# Altium schematic sheet general_Interface.SchDoc
size A4
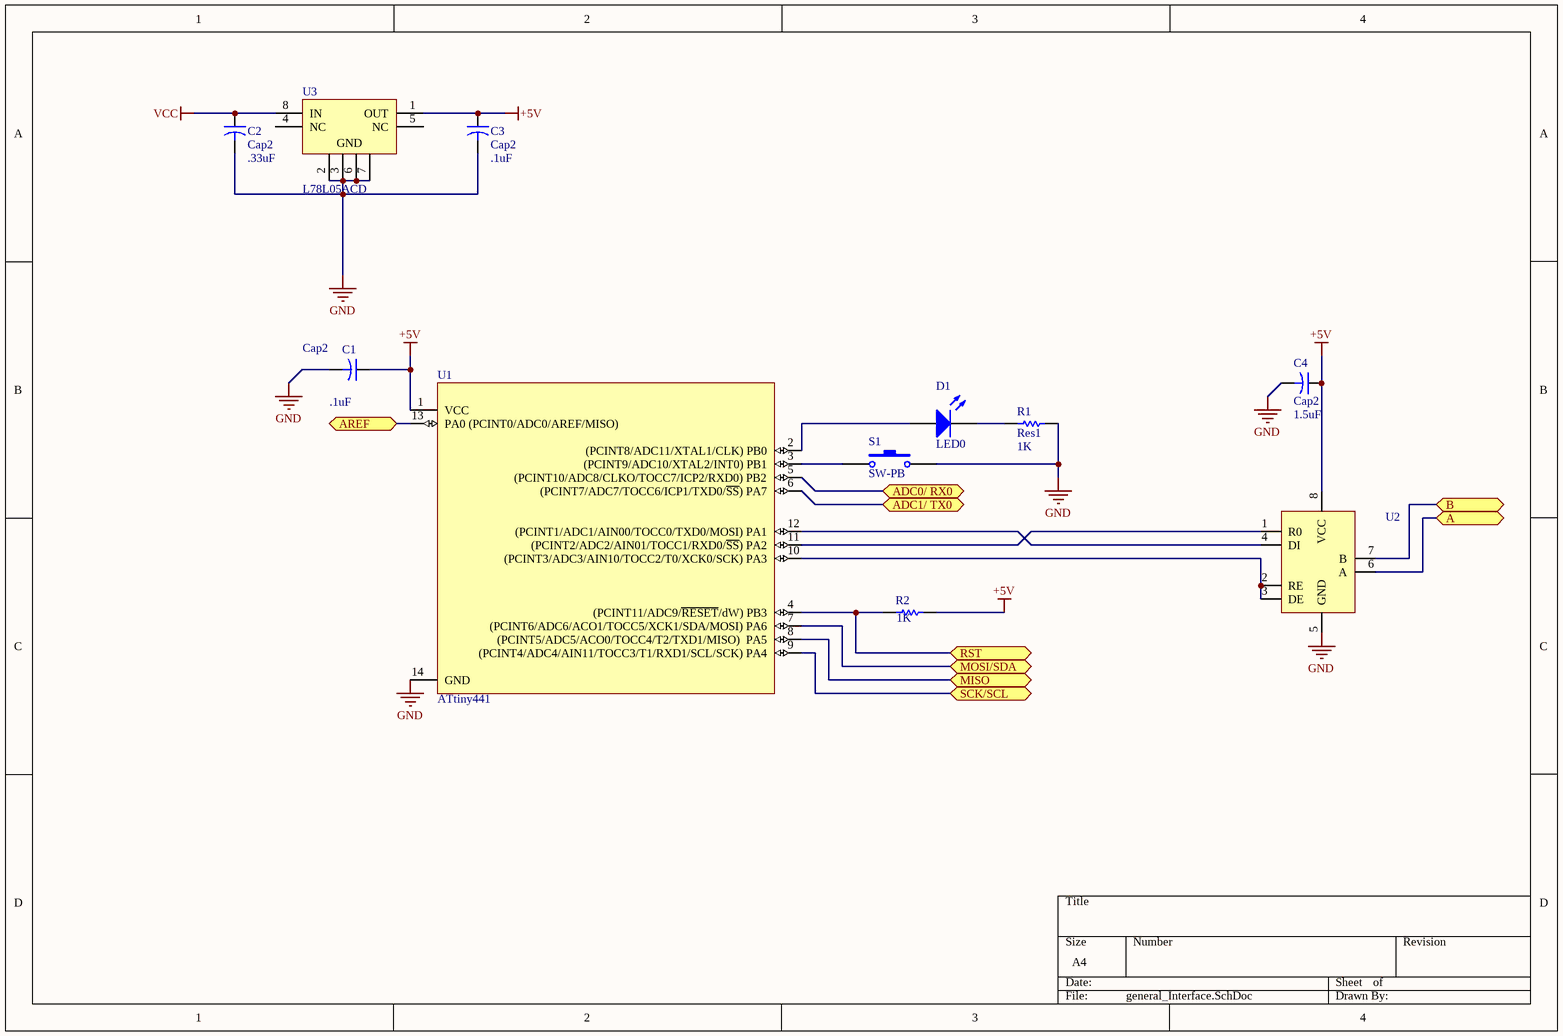
[diagram p0: general_Interface.SchDoc]

## Parts
C1  Cap2  value .1uF  [6-0805_N]
C2  Cap2  value .33uF  [6-0805_N]
C3  Cap2  value .1uF  [6-0805_N]
C4  Cap2  value 1.5uF  [6-0805_N]
D1  LED0  [1608[0603]]
R1  Res1  value 1K  [6-0805_N]
R2  value 1K  [J1-0603]  (hidden comment: Res1)
S1  SW-PB  [ADTSM3]
U1  ATtiny441  [6ST1_L]
U2  SP485  [8S1_M]  (value not drawn)
U3  L78L05ACD  [8S1_N]

## Ports
A, ADC0/ RX0, ADC1/ TX0, AREF, B, MISO, MOSI/SDA, RST, SCK/SCL

## Nets
+5V: C1.1 C3.1 C4.1 R2.2 U1.1(VCC) U2.8(VCC) U3.1(OUT)
GND: C1.2 C2.2 C3.2 C4.2 R1.2 S1.2 U1.14(GND) U2.5(GND) U3.2(GND) U3.3(GND) U3.6(GND) U3.7(GND)
VCC: C2.1 U3.8(IN)
A: U2.6(A) ; port A
ADC0/ RX0: U1.5((PCINT10/ADC8/CLKO/TOCC7/ICP2/RXD0)_PB2) ; port ADC0/ RX0
ADC1/ TX0: U1.6((PCINT7/ADC7/TOCC6/ICP1/TXD0/~{SS})_PA7) ; port ADC1/ TX0
AREF: U1.13(PA0_(PCINT0/ADC0/AREF/MISO)) ; port AREF
B: U2.7(B) ; port B
MISO: U1.8((PCINT5/ADC5/ACO0/TOCC4/T2/TXD1/MISO)__PA5) ; port MISO
MOSI/SDA: U1.7((PCINT6/ADC6/ACO1/TOCC5/XCK1/SDA/MOSI)_PA6) ; port MOSI/SDA
RST: R2.1 U1.4((PCINT11/ADC9/~{RESET}/dW)_PB3) ; port RST
SCK/SCL: U1.9((PCINT4/ADC4/AIN11/TOCC3/T1/RXD1/SCL/SCK)_PA4) ; port SCK/SCL
NetD1_1: D1.1(A) U1.2((PCINT8/ADC11/XTAL1/CLK)_PB0)
NetD1_2: D1.2(K) R1.1
NetS1_1: S1.1 U1.3((PCINT9/ADC10/XTAL2/INT0)_PB1)
NetU1_10: U1.10((PCINT3/ADC3/AIN10/TOCC2/T0/XCK0/SCK)_PA3) U2.2(RE) U2.3(DE)
NetU1_11: U1.11((PCINT2/ADC2/AIN01/TOCC1/RXD0/~{SS})_PA2) U2.1(R0)
NetU1_12: U1.12((PCINT1/ADC1/AIN00/TOCC0/TXD0/MOSI)_PA1) U2.4(DI)

Not connected (* = marked no-connect by the designer): U3 4(NC) 5(NC)

## Library data of the parts
C1-C4 = Cap2: Capacitor; Published: 23-Sep-2002; PackageReference: CAPR5-4X5; Publisher: Altium Limited; PackageDescription: Capacitor; 2 Leads
D1 = LED0: Typical INFRARED GaAs LED; Published: 8-Jun-2000; LatestRevisionDate: 08-Jul-2005; LatestRevisionNote: Mech Layer 1 removed.; PackageReference: LED-0; Publisher: Altium Limited; PackageDescription: LED; 2 Leads
R1 R2 = Res1: Resistor; Published: 8-Jun-2000; LatestRevisionDate: 17-Jul-2002; LatestRevisionNote: Re-released for DXP Platform.; PackageReference: AXIAL-0.3; Publisher: Altium Limited; PackageDescription: Axial Device, Thru-Hole; 2 Leads; 0.3 in Pin Spacing
S1 = SW-PB: Switch; Published: 24-Mar-1999; LatestRevisionDate: 17-Jul-2002; LatestRevisionNote: Re-released for DXP Platform.; PackageReference: SPST-2; Publisher: Altium Limited; PackageDescription: Switch; 2 Leads
U3 = L78L05ACD: Positive Voltage Regulator; Published: 24-Aug-2001; LatestRevisionDate: 13-Apr-2006; LatestRevisionNote: IPC-7351 Footprint Added.; DatasheetVersion: Feb-1999; PackageVersion: Dec-2002; PackageReference: SO8; Publisher: Altium Limited; PackageDescription: 8-Pin Small Outline Integrated Circuit 1.27 mm Pitch; Code_JEDEC: MS-012-AA; Code_IPC: SOIC127P600-8; ComponentLink1Description: Manufacturer Link; ComponentLink1URL: http://www.st.com/